# EAGLE design RGBWdriver (EAGLE 5.11)
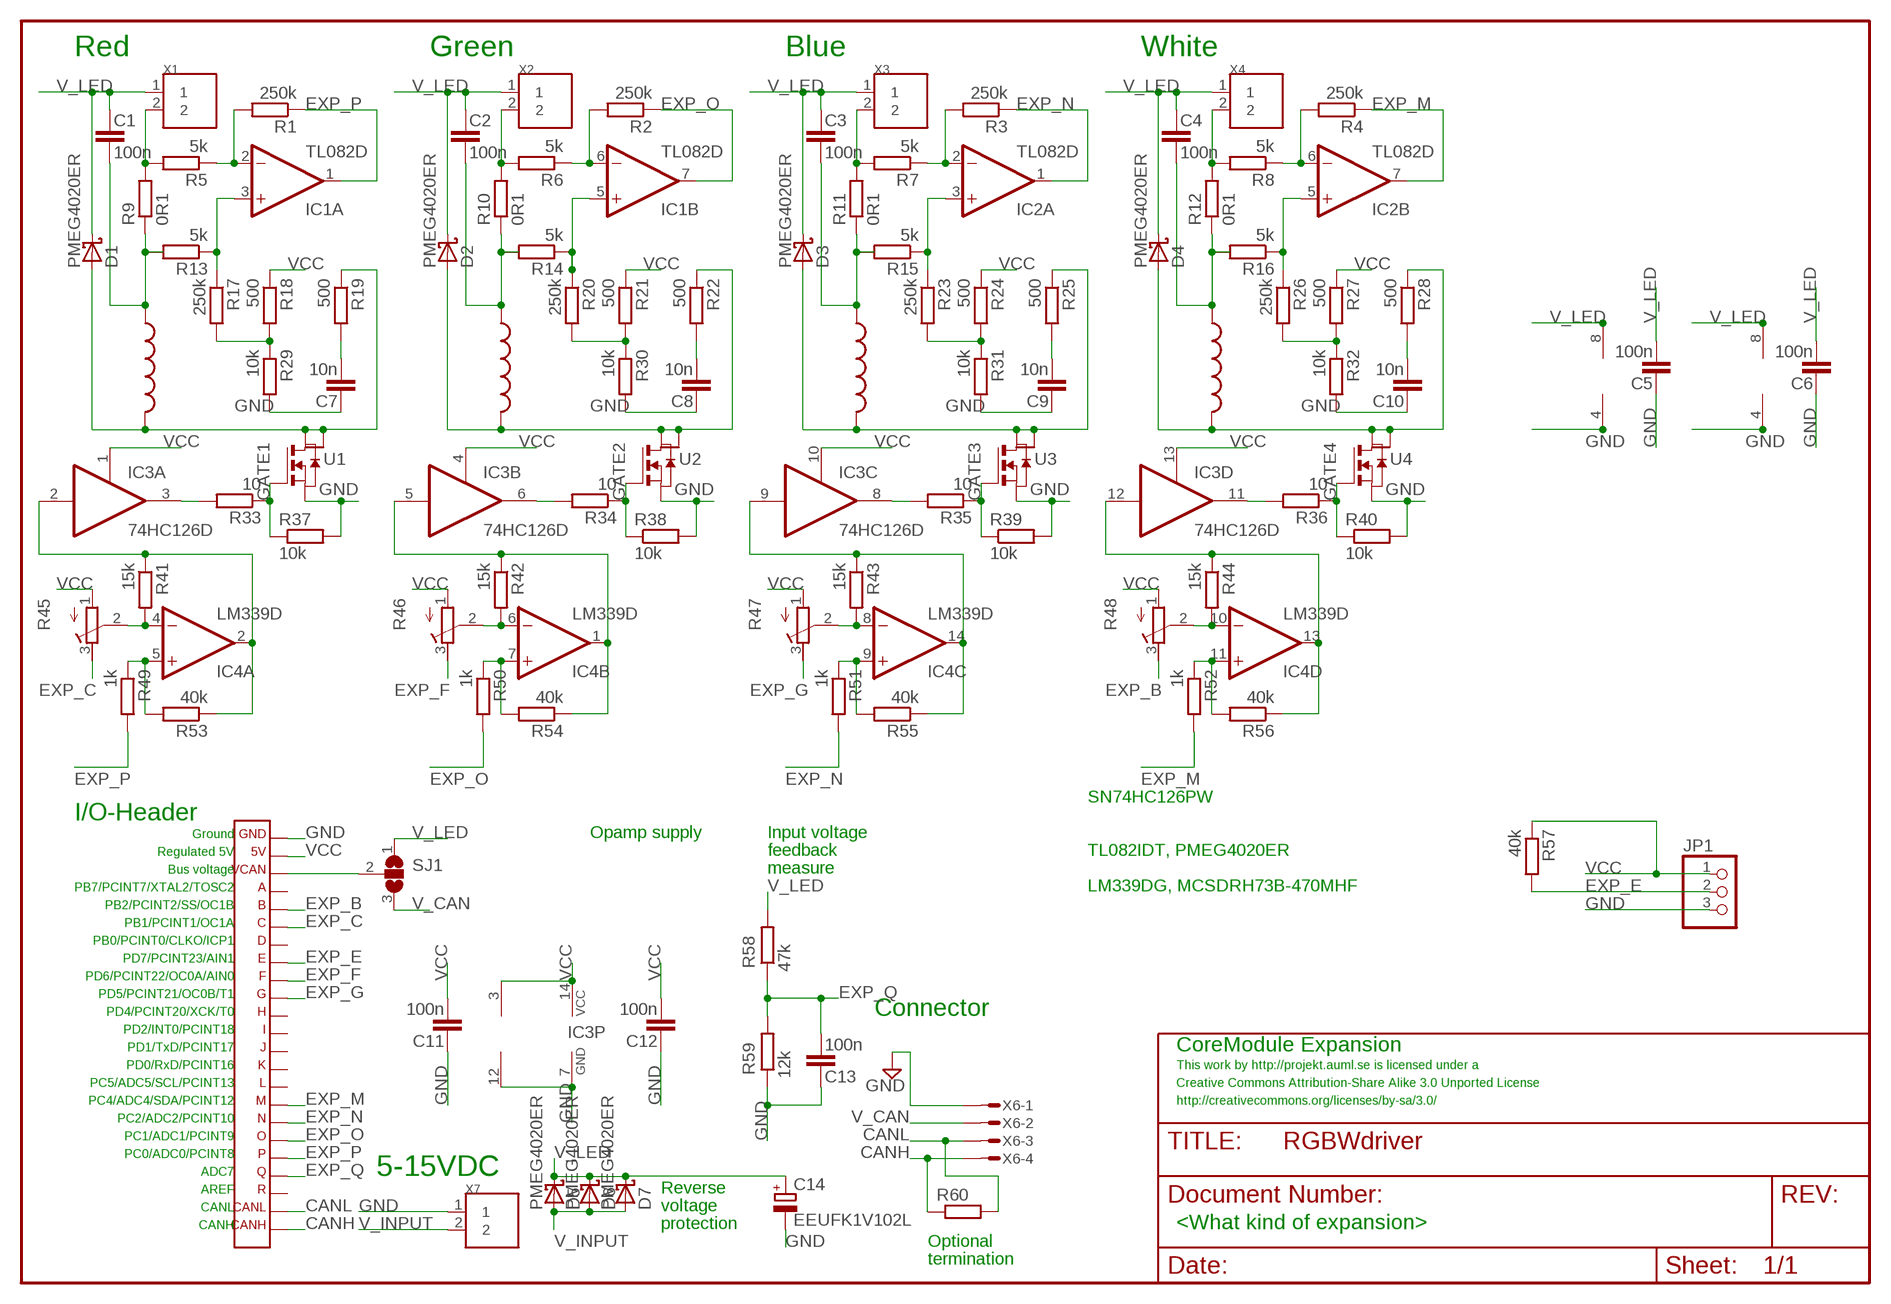
[diagram p0: schematic, sheet 1]

## Parts
C1  100n  C-EUC1210  [C1210]
C2  100n  C-EUC1210  [C1210]
C3  100n  C-EUC1210  [C1210]
C4  100n  C-EUC1210  [C1210]
C5  100n  C-EUC0603  [C0603]
C6  100n  C-EUC0603  [C0603]
C7  10n  C-EUC0603  [C0603]
C8  10n  C-EUC0603  [C0603]
C9  10n  C-EUC0603  [C0603]
C10  10n  C-EUC0603  [C0603]
C11  100n  C-EUC0603  [C0603]
C12  100n  C-EUC0603  [C0603]
C13  100n  C-EUC0603  [C0603]
C14  EEUFK1V102L  CPOL-EUTT5D10  [TT5D10]
D1  PMEG4020ER  SCHOTTKY-DIODE  [SOD-123W]
D2  PMEG4020ER  SCHOTTKY-DIODE  [SOD-123W]
D3  PMEG4020ER  SCHOTTKY-DIODE  [SOD-123W]
D4  PMEG4020ER  SCHOTTKY-DIODE  [SOD-123W]
D5  PMEG4020ER  SCHOTTKY-DIODE  [SOD-123W]
D6  PMEG4020ER  SCHOTTKY-DIODE  [SOD-123W]
D7  PMEG4020ER  SCHOTTKY-DIODE  [SOD-123W]
IC1  TL082D  [SO08]
IC2  TL082D  [SO08]
IC3  74HC126D  [SO14]
IC4  LM339D  [SO14]
JP1  PINHD-1X3  [1X03]
L1  12X12  [12X12]
L2  12X12  [12X12]
L3  12X12  [12X12]
L4  12X12  [12X12]
R1  250k  R-EUR0603  [R0603]
R2  250k  R-EUR0603  [R0603]
R3  250k  R-EUR0603  [R0603]
R4  250k  R-EUR0603  [R0603]
R5  5k  R-EUR0603  [R0603]
R6  5k  R-EUR0603  [R0603]
R7  5k  R-EUR0603  [R0603]
R8  5k  R-EUR0603  [R0603]
R9  0R1  R-EUR1206  [R1206]
R10  0R1  R-EUR1206  [R1206]
R11  0R1  R-EUR1206  [R1206]
R12  0R1  R-EUR1206  [R1206]
R13  5k  R-EUR0603  [R0603]
R14  5k  R-EUR0603  [R0603]
R15  5k  R-EUR0603  [R0603]
R16  5k  R-EUR0603  [R0603]
R17  250k  R-EUR0603  [R0603]
R18  500  R-EUR0603  [R0603]
R19  500  R-EUR0603  [R0603]
R20  250k  R-EUR0603  [R0603]
R21  500  R-EUR0603  [R0603]
R22  500  R-EUR0603  [R0603]
R23  250k  R-EUR0603  [R0603]
R24  500  R-EUR0603  [R0603]
R25  500  R-EUR0603  [R0603]
R26  250k  R-EUR0603  [R0603]
R27  500  R-EUR0603  [R0603]
R28  500  R-EUR0603  [R0603]
R29  10k  R-EUR0603  [R0603]
R30  10k  R-EUR0603  [R0603]
R31  10k  R-EUR0603  [R0603]
R32  10k  R-EUR0603  [R0603]
R33  10  R-EUR0603  [R0603]
R34  10  R-EUR0603  [R0603]
R35  10  R-EUR0603  [R0603]
R36  10  R-EUR0603  [R0603]
R37  10k  R-EUR0603  [R0603]
R38  10k  R-EUR0603  [R0603]
R39  10k  R-EUR0603  [R0603]
R40  10k  R-EUR0603  [R0603]
R41  15k  R-EUR0603  [R0603]
R42  15k  R-EUR0603  [R0603]
R43  15k  R-EUR0603  [R0603]
R44  15k  R-EUR0603  [R0603]
R45  R-TRIM  [TRIM_PVZ3]
R46  R-TRIM  [TRIM_PVZ3]
R47  R-TRIM  [TRIM_PVZ3]
R48  R-TRIM  [TRIM_PVZ3]
R49  1k  R-EUR0603  [R0603]
R50  1k  R-EUR0603  [R0603]
R51  1k  R-EUR0603  [R0603]
R52  1k  R-EUR0603  [R0603]
R53  40k  R-EUR0603  [R0603]
R54  40k  R-EUR0603  [R0603]
R55  40k  R-EUR0603  [R0603]
R56  40k  R-EUR0603  [R0603]
R57  40k  R-EUR0603  [R0603]
R58  47k  R-EUR0603  [R0603]
R59  12k  R-EUR0603  [R0603]
R60  R-EUR0603  [R0603]
SJ1  SJ_2_NO"  [SJ_2_NO]
U1  NFT3055L175  [SOT223]
U2  NFT3055L175  [SOT223]
U3  NFT3055L175  [SOT223]
U4  NFT3055L175  [SOT223]
X1  BLOCK2  [PCB2]
X2  BLOCK2  [PCB2]
X3  BLOCK2  [PCB2]
X4  BLOCK2  [PCB2]
X5  CORETWO_LAYOUTISPHOLES_CU  [CORETWO_LAYOUT_ISPHOLES_CU]
X6  MICROMATCH-4  [MICROMATCH-4]
X7  BLOCK2  [PCB2]

## Nets
CANH: R60.1 X5.CANH X6.4
CANL: R60.2 X5.CANL X6.3
EXP_B: R48.3(PAD3) X5.B
EXP_C: R45.3(PAD3) X5.C
EXP_E: JP1.2 R57.2 X5.E
EXP_F: R46.3(PAD3) X5.F
EXP_G: R47.3(PAD3) X5.G
EXP_M: IC2.7(B:OUT) R4.1 R52.2 X5.M
EXP_N: IC2.1(A:OUT) R3.1 R51.2 X5.N
EXP_O: IC1.7(B:OUT) R2.1 R50.2 X5.O
EXP_P: IC1.1(A:OUT) R1.1 R49.2 X5.P
EXP_Q: C13.2 R58.1 R59.2 X5.Q
GATE1: R33.1 R37.1 U1.1(G)
GATE2: R34.1 R38.1 U2.1(G)
GATE3: R35.1 R39.1 U3.1(G)
GATE4: R36.1 R40.1 U4.1(G)
GND: C5.1 C6.1 C7.1 C8.1 C9.1 C10.1 C11.1 C12.1 C13.1 C14.- IC1.4(P:V-) IC2.4(P:V-) IC3.7(P:GND) IC4.12(P:GND) JP1.3 R29.2 R30.2 R31.2 R32.2 R37.2 R38.2 R39.2 R40.2 R59.1 U1.3(S) U2.3(S) U3.3(S) U4.3(S) X5.GND X6.1 X7.1
L1: D1.A L1.P$2 R19.1 U1.2(D) U1.4(D_PAD)
L2: D4.A L4.P$2 R28.1 U4.2(D) U4.4(D_PAD)
L3: D2.A L2.P$2 R22.1 U2.2(D) U2.4(D_PAD)
L4: D3.A L3.P$2 R25.1 U3.2(D) U3.4(D_PAD)
N$1: IC4.5(A:+IN) R49.1 R53.2
N$2: IC3.2(A:I) IC4.2(A:OUT) R41.1 R53.1
N$3: C2.2 L2.P$1 R10.1 R14.2
N$4: R6.2 R10.2 X2.2
N$5: C1.2 L1.P$1 R9.1 R13.2
N$6: IC1.6(B:-IN) R2.2 R6.1
N$7: SJ1.2 X5.VCAN
N$9: IC1.5(B:+IN) R14.1 R20.1
N$11: C3.2 L3.P$1 R11.1 R15.2
N$12: R5.2 R9.2 X1.2
N$13: R7.2 R11.2 X3.2
N$14: IC2.2(A:-IN) R3.2 R7.1
N$17: IC2.3(A:+IN) R15.1 R23.1
N$19: IC1.3(A:+IN) R13.1 R17.1
N$20: C4.2 L4.P$1 R12.1 R16.2
N$21: IC1.2(A:-IN) R1.2 R5.1
N$22: R8.2 R12.2 X4.2
N$23: IC2.6(B:-IN) R4.2 R8.1
N$26: IC2.5(B:+IN) R16.1 R26.1
N$28: IC3.3(A:O) R33.2
N$29: C7.2 R19.2
N$30: IC4.4(A:-IN) R41.2 R45.2(PAD2)
N$32: R17.2 R18.2 R29.1
N$35: IC4.11(D:+IN) R52.1 R56.2
N$36: IC4.10(D:-IN) R44.2 R48.2(PAD2)
N$37: IC3.12(D:I) IC4.13(D:OUT) R44.1 R56.1
N$38: IC3.11(D:O) R36.2
N$39: R26.2 R27.2 R32.1
N$40: C10.2 R28.2
N$41: IC4.7(B:+IN) R50.1 R54.2
N$42: IC4.6(B:-IN) R42.2 R46.2(PAD2)
N$43: IC3.5(B:I) IC4.1(B:OUT) R42.1 R54.1
N$44: IC3.6(B:O) R34.2
N$45: R20.2 R21.2 R30.1
N$46: C8.2 R22.2
N$47: IC4.9(C:+IN) R51.1 R55.2
N$48: IC4.8(C:-IN) R43.2 R47.2(PAD2)
N$49: IC3.9(C:I) IC4.14(C:OUT) R43.1 R55.1
N$50: IC3.8(C:O) R35.2
N$51: R23.2 R24.2 R31.1
N$52: C9.2 R25.2
V_CAN: SJ1.3 X6.2
V_INPUT: D5.A D6.A D7.A X7.2
V_LED: C1.1 C2.1 C3.1 C4.1 C5.2 C6.2 C14.+ D1.C D2.C D3.C D4.C D5.C D6.C D7.C IC1.8(P:V+) IC2.8(P:V+) R58.2 SJ1.1 X1.1 X2.1 X3.1 X4.1
VCC: C11.2 C12.2 IC3.1(A:OE) IC3.4(B:OE) IC3.10(C:OE) IC3.13(D:OE) IC3.14(P:VCC) IC4.3(P:V+) JP1.1 R18.1 R21.1 R24.1 R27.1 R45.1(PAD1) R46.1(PAD1) R47.1(PAD1) R48.1(PAD1) R57.1 X5.5V
Unconnected: X5.A X5.D X5.H X5.I X5.J X5.K X5.L X5.R

## Notes on the sheet
- Red | Green | Blue | White
- SN74HC126PW
- I/O-Header
- Ground | Opamp supply | Input voltage
- Regulated 5V | feedback | TL082IDT, PMEG4020ER
- Bus voltage | measure
- PB7/PCINT7/XTAL2/TOSC2 | LM339DG, MCSDRH73B-470MHF
- PB2/PCINT2/SS/OC1B
- PB1/PCINT1/OC1A
- PB0/PCINT0/CLKO/ICP1
- PD7/PCINT23/AIN1
- PD6/PCINT22/OC0A/AIN0
- PD5/PCINT21/OC0B/T1
- PD4/PCINT20/XCK/T0 | Connector
- PD2/INT0/PCINT18
- PD1/TxD/PCINT17 | CoreModule Expansion
- PD0/RxD/PCINT16 | This work by http://projekt.auml.se is licensed under a
- PC5/ADC5/SCL/PCINT13 | Creative Commons Attribution-Share Alike 3.0 Unported License
- PC4/ADC4/SDA/PCINT12 | http://creativecommons.org/licenses/by-sa/3.0/
- PC2/ADC2/PCINT10
- PC1/ADC1/PCINT9
- PC0/ADC0/PCINT8
- ADC7 | 5-15VDC
- AREF | Reverse
- CANL | voltage
- CANH | protection | <What kind of expansion>
- Optional
- termination

## Library data of the parts
C1-C13 = rcl:C-EU
C14 = rcl:CPOL-EU: POLARIZED CAPACITOR, European symbol
D1-D7 = diode:SCHOTTKY-DIODE
IC1 IC2 = linear:TL082: OP AMP
IC3 = 74xx-eu:74*126: Quad bus BUFFER, 3-state
IC4 = linear:LM339: Low Power Low Offset Voltage Quad Comparators with open collector; LM139/LM239/LM339/LM2901/LM3302
JP1 = pinhead:PINHD-1X3: PIN HEADER
L1-L4 = inductor10x10:12X12
R1-R44 R49-R60 = rcl:R-EU
R45-R48 = rcl:R-TRIM
SJ1 = jumper:SJ_2_NO
U1-U4 = NMOS_NTF3055L175:NFT3055L175
X1-X4 X7 = terminal_block:BLOCK2
X5 = expboard:CORETWO_LAYOUT
X6 = con-amp-micromatch:MICROMATCH-4: MicroMaTch 4 7-215464-4 / 0-215464-4 Drawing Number C-215464 DDEController.pdf

## Board
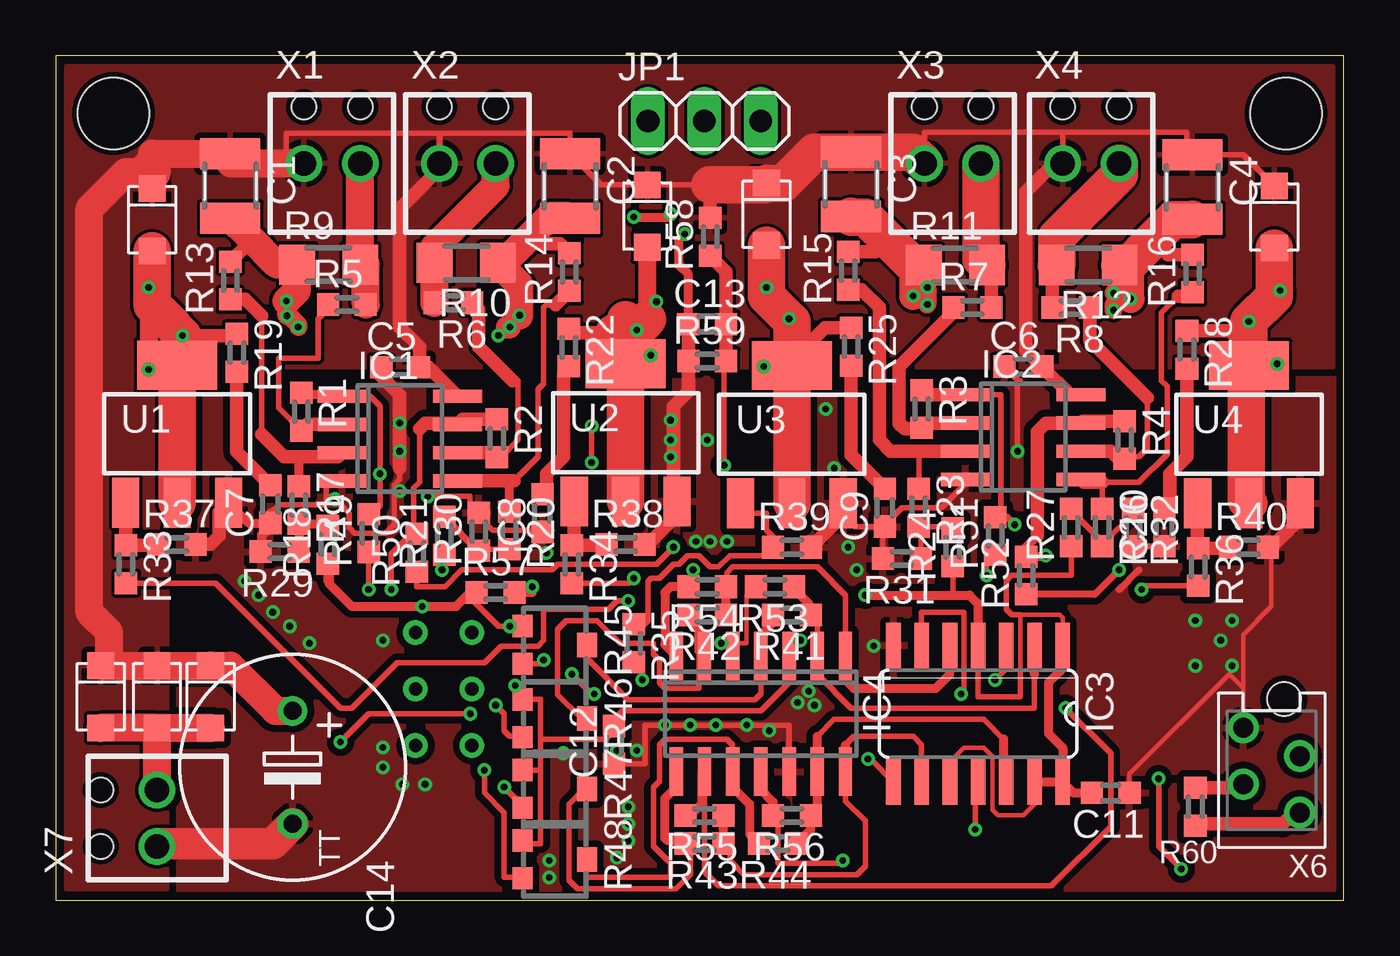
[diagram p1: board, top side]
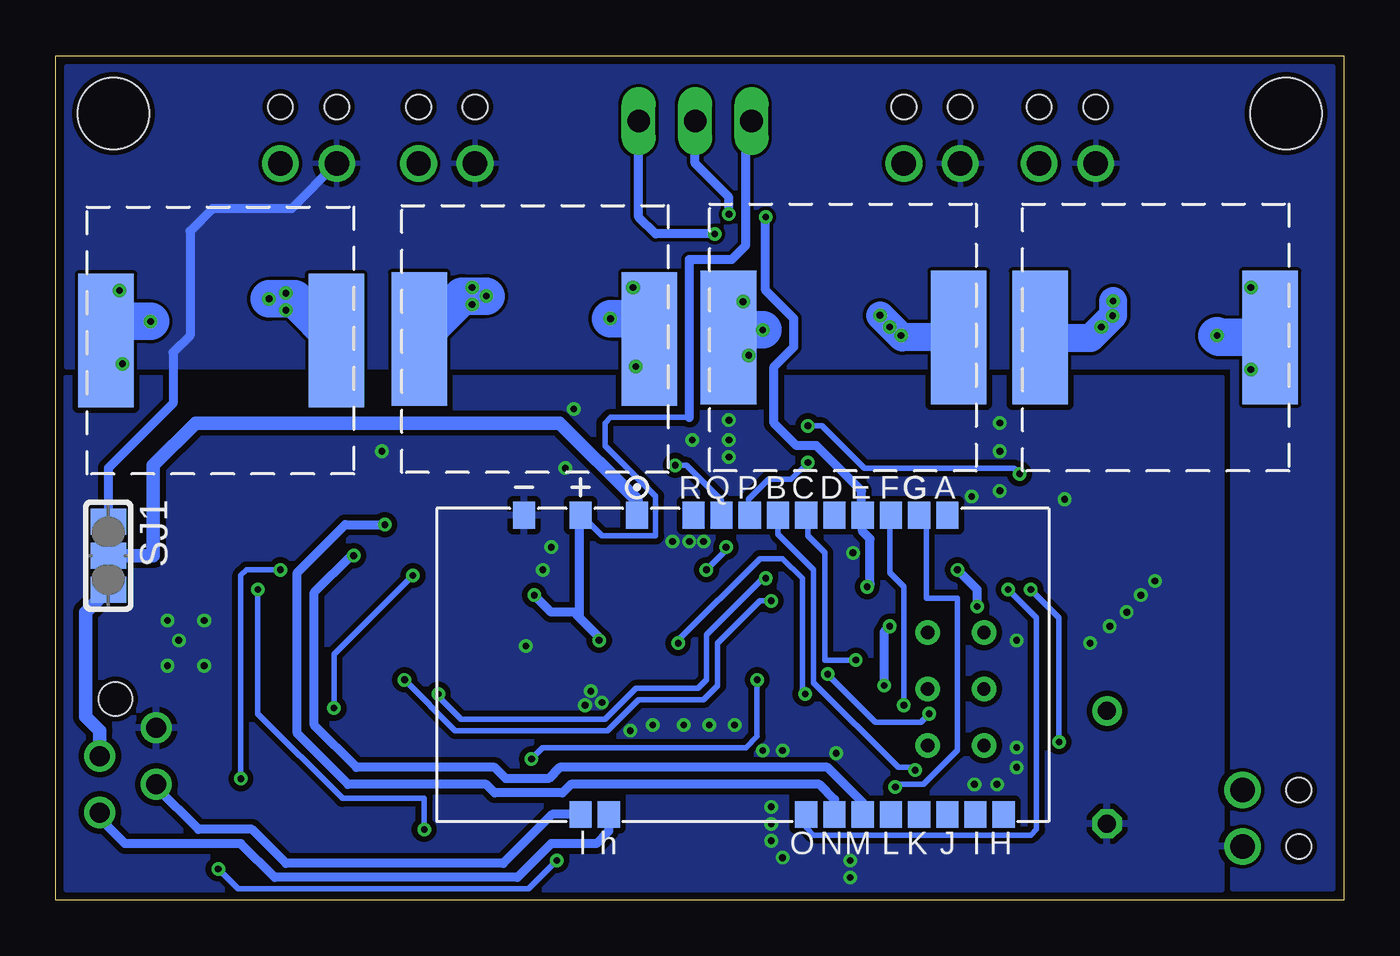
[diagram p2: board, bottom side, seen from below]

Size 58 x 38 mm. Coordinates in mm from the lower left corner, seen from the top.
Outline: 0,0 58,0 58,38 0,38 0,0
Copper layers (1*16): Top 0.035mm / dielectric 1.5mm / Bottom 0.035mm
Design rules "ITead_rule *": minimum track width 6mil, minimum drill 12mil, track to track 6mil, track to pad 6mil, pad to pad 6mil, via to via 6mil, smd to smd 0mil, copper to edge 10mil, drill to drill 10mil, minimum pad ring 10mil, minimum via ring 6mil, stop-mask expansion 2mil, vias tented up to drill 100mil, thermal gap 10mil
Holes 3.2 mm at 2.6,35.4 55.4,35.4

### Footprints (pad centres in the part's own frame; a part is rotated, then mirrored left to right if it is on the bottom)
C1210 = smd 1.4 x 2.7: 1 -1.4,0; 2 1.5,0
C0603 = smd 1 x 1: 1 -0.85,0; 2 0.85,0
TT5D10 = drill 0.813 round: + -2.54,0 | drill 0.813 octagon: - 2.54,0
SOD-123W = smd 1.2 x 1.2: A 1.4,0; C -1.4,0
SO08 = smd 0.6 x 2.2: 1 -1.905,-2.6; 2 -0.635,-2.6; 3 0.635,-2.6; 4 1.905,-2.6; 5 1.905,2.6; 6 0.635,2.6; 7 -0.635,2.6; 8 -1.905,2.6
SO14 = smd 0.66 x 2.032: 1 -3.81,-3.073; 2 -2.54,-3.073; 3 -1.27,-3.073; 4 0,-3.073; 5 1.27,-3.073; 6 2.54,-3.073; 7 3.81,-3.073; 8 3.81,3.073; 9 2.54,3.073; 10 1.27,3.073; 11 0,3.073; 12 -1.27,3.073; 13 -2.54,3.073; 14 -3.81,3.073
SO14' = smd 0.6 x 2.2: 1 -3.81,-2.6; 2 -2.54,-2.6; 3 -1.27,-2.6; 4 0,-2.6; 5 1.27,-2.6; 6 2.54,-2.6; 7 3.81,-2.6; 8 3.81,2.6; 9 2.54,2.6; 10 1.27,2.6; 11 0,2.6; 12 -1.27,2.6; 13 -2.54,2.6; 14 -3.81,2.6
1X03 = drill 1.016 long: 1 -2.54,0; 2 0,0; 3 2.54,0
12X12 = smd 6 x 2.5: P$1 6,0.79; P$2 6,11.15
R0603 = smd 0.991 x 1.016: 1 -0.85,0; 2 0.85,0
R1206 = smd 1.6 x 1.803: 1 -1.422,0; 2 1.422,0
TRIM_PVZ3 = smd 1 x 0.9: 1 0.5,0.45; 3 2.2,0.45 | smd 1.1 x 0.9: 2 1.35,3.35
SJ_2_NO = smd 1.168 x 1.6: 1 -1.524,0; 2 0,0; 3 1.524,0
SOT223 = smd 1.219 x 2.235: 1 -2.311,-3.099; 2 0,-3.099; 3 2.311,-3.099 | smd 3.6 x 2.2: 4 0,3.099
PCB2 = drill 1.1 round: 1 -2.54,0; 2 0,0 | hole 1.1: -2.54,2.54; 0,2.54
CORETWO_LAYOUT_ISPHOLES_CU = smd 1 x 1.2: 5V 7.315,-6.648; A -9.195,-6.648; B -1.575,-6.648; C -2.845,-6.648; CANH 6.045,6.814; CANL 7.315,6.814; D -4.115,-6.648; E -5.385,-6.648; F -6.655,-6.648; G -7.925,-6.648; GND 9.855,-6.648; H -11.735,6.814; I -10.465,6.814; J -9.195,6.814; K -7.925,6.814; L -6.655,6.814; M -5.385,6.814; N -4.115,6.814; O -2.845,6.814; P -0.305,-6.648; Q 0.965,-6.648; R 2.235,-6.648; VCAN 4.775,-6.648 | drill 0.6 round: P$1 -10.846,3.708; P$2 -8.306,3.708; P$3 -10.846,1.168; P$4 -8.306,1.168; P$5 -8.306,-1.372; P$6 -10.846,-1.372
MICROMATCH-4 = drill 0.9 round: 1 1.905,1.27; 2 0.635,-1.27; 3 -0.635,1.27; 4 -1.905,-1.27 | hole 1.5: 3.199,-0.562

### Placement (x,y rotation side)
C1  7.87,32.19 270 top
C2  23.16,32.18 270 top
C3  35.81,32.26 270 top
C4  51.18,32.13 270 top
C5  15.52,23.98 0 top
C6  43.56,24 0 top
C7  9.67,17.81 90 top
C8  21.92,17.41 90 top
C9  37.34,17.65 90 top
C10  49.91,16.76 90 top
C11  47.5,4.83 180 top
C12  25.15,6.99 90 top
C13  29.34,25.91 0 top
C14  10.67,5.97 270 top
D1  4.35,30.61 270 top
D2  26.64,30.78 270 top
D3  32,30.86 270 top
D4  54.86,30.73 270 top
D5  2.03,9.14 270 top
D6  4.57,9.14 270 top
D7  6.99,9.14 270 top
IC1  15.5,20.77 270 top
IC2  43.56,20.83 270 top
IC3  41.53,8.38 180 top
IC4  LM339D  [SO14']  31.75,8.38 180 top
JP1  29.21,35.05 0 top
L1  14.48,31.32 270 bottom
L2  16.56,19.32 90 bottom
L3  42.42,31.24 270 bottom
L4  44.58,19.18 90 bottom
R1  11.06,21.98 270 top
R2  19.87,20.78 270 top
R3  38.99,22.1 270 top
R4  48.13,20.7 270 top
R5  13.11,26.8 0 top
R6  17.91,26.88 180 top
R7  41.27,26.67 0 top
R8  45.72,26.67 180 top
R9  12.3,28.59 0 top
R10  18.49,28.67 180 top
R11  40.51,28.57 0 top
R12  46.48,28.57 180 top
R13  7.87,27.88 90 top
R14  23.13,28.26 90 top
R15  35.69,28.32 90 top
R16  51.18,28.19 90 top
R17  10.96,17.77 270 top
R18  12.25,15.99 90 top
R19  8.16,24.62 270 top
R20  20.43,16.63 270 top
R21  17.49,16.39 90 top
R22  23.1,24.86 270 top
R23  38.86,17.65 270 top
R24  40.39,15.88 90 top
R25  35.81,24.89 270 top
R26  47.12,16.76 270 top
R27  45.72,16.76 90 top
R28  50.93,24.77 270 top
R29  10.09,15.68 180 top
R30  19.05,16.58 90 top
R31  38.1,15.37 180 top
R32  48.51,16.76 270 top
R33  3.17,15.11 270 top
R34  23.24,15.11 270 top
R35  26.04,11.56 270 top
R36  51.44,14.99 270 top
R37  5.46,16 0 top
R38  25.65,16 0 top
R39  33.15,15.88 0 top
R40  53.72,15.88 0 top
R41  33.15,12.83 180 top
R42  29.34,12.83 180 top
R43  29.21,2.54 180 top
R44  32.51,2.54 180 top
R45  20.57,12.83 270 top
R46  20.57,9.53 270 top
R47  20.57,6.35 270 top
R48  20.57,3.17 270 top
R49  14.1,16.51 90 top
R50  16.26,15.62 90 top
R51  42.29,16.38 90 top
R52  43.69,14.61 90 top
R53  32.38,14.1 180 top
R54  29.34,14.1 180 top
R55  29.21,3.81 180 top
R56  33.15,3.81 180 top
R57  19.81,13.84 0 top
R58  29.46,29.84 90 top
R59  29.34,24.26 0 top
R60  51.31,4.19 90 top
SJ1  55.63,15.49 270 bottom
U1  5.48,20.97 0 top
U2  25.66,21.04 0 top
U3  33.15,20.95 0 top
U4  53.72,20.95 0 top
X1  13.72,33.15 0 top
X2  19.81,33.15 0 top
X3  41.66,33.15 0 top
X4  47.88,33.15 0 top
X5  27.05,10.67 180 bottom
X6  54.74,5.84 90 top
X7  4.57,4.95 90 top

### Tracks (layer width: path | path; a pad name or v marks a point on that pad's centre or on a via)
CANH
  Top 0.61: R60.1 51.4,3.43 55.24,3.43 55.75,3.94 X6.4
  Bottom 0.406: X5.CANH 33.1,3.1 33.66,2.54 35.69,2.54 37.21,1.02 48.13,1.02 49.66,2.54 54.86,2.54 56.01,3.68 X6.4
CANL
  Top 0.61: X6.3 53.3,5.04 R60.2
  Bottom 0.406: X5.CANL 35.64,3.85 37.85,1.65 47.62,1.65 49.15,3.17 51.56,3.17 53.47,5.08 X6.3
EXP_B  (via drill 0.3)
  Top 0.254: v19.3,5.84 19.3,4.83 20.19,3.94 20.19,1.02 20.98,1.02 R48.3
  Bottom 0.254: X5.B 25.48,16.46 23.88,14.86 23.88,9.78 20.07,5.97 19.43,5.97 v19.3,5.84
EXP_C  (via drill 0.3)
  Top 0.254: v21.97,10.79 21.8,10.63 R45.3
  Bottom 0.254: v21.97,10.79 23.37,10.79 23.37,15.62 24.13,16.38 24.13,17.32 X5.C
EXP_E  (via drill 0.3)
  Top 0.406: v26.04,30.73 27.69,30.73 v27.69,30.86 | R57.2 21.46,13.84 v21.46,14.1
  Bottom 0.406: v26.04,30.73 26.04,27.43 24.77,26.16 24.77,24.89 25.65,24 25.65,21.46 24.64,20.45 23.75,20.45 21.72,18.41 21.72,17.32 X5.E 21.67,16.59 21.34,16.26 21.34,14.22 v21.46,14.1 | v27.69,30.86 27.69,31.62 29.21,33.15 JP1.2
EXP_F  (via drill 0.3)
  Top 0.254: v19.81,8.76 20.19,8.38 20.19,7.62 20.45,7.37 20.98,7.37 R46.3
  Bottom 0.254: v19.81,8.76 19.81,14.1 20.45,14.73 20.45,16.76 20.4,16.82 X5.F
EXP_G  (via drill 0.3)
  Top 0.254: 20.94,4.06 R47.3 21.02,4.25 v20.19,5.08
  Bottom 0.254: X5.G 18.8,17.32 18.8,13.59 17.4,13.59 17.4,6.73 18.92,5.21 20.07,5.21 v20.19,5.08
EXP_M  (via drill 0.3)
  Top 0.406: v44.58,15.49 44.58,15.46 R52.2 43.69,15.88 44.2,16.38
  Top 0.61: R4.1 46.25,21.55 IC2.7 44.58,21.46 44.2,21.08 44.2,16.38
  Bottom 0.406: X5.M 21.67,4.39 23.24,5.97 35.31,5.97 35.81,5.46 37.72,5.46 38.23,5.97 44.45,5.97 46.35,7.87 46.35,13.84 44.7,15.49 v44.58,15.49
EXP_N  (via drill 0.3)
  Top 0.254: IC2.1 42.55,22.73 42.55,17.53 42.29,17.27 R51.2 42.55,17.49
  Top 0.305: v43.18,16.89 42.84,17.23 R51.2
  Top 0.61: IC2.1 39.2,22.73 R3.1
  Bottom 0.406: X5.N 22.94,4.52 23.62,5.21 34.8,5.21 35.18,4.83 38.23,4.83 38.61,5.21 44.83,5.21 47.12,7.49 47.12,14.73 44.96,16.89 v43.18,16.89
EXP_O  (via drill 0.3)
  Top 0.254: v15.11,13.97 15.11,15.58 16,16.47 R50.2 16.13,16.47 16.13,18.54 16.38,18.8 16.38,21.21
  Top 0.61: R2.1 18.33,21.63 IC1.7 18.03,21.46 16.64,21.46 16.38,21.21
  Bottom 0.254: X5.O 24.21,3.25 23.88,2.92 14.1,2.92 13.84,3.17 13.84,12.7 v15.11,13.97
EXP_P  (via drill 0.3)
  Top 0.254: v24.13,21.34 v24.13,19.68 | IC1.1 14.16,22.67 14.61,22.23 v14.61,19.18 14.61,17.74 14.22,17.36 R49.2
  Top 0.406: IC1.1 12.13,22.67 12.06,22.73 11.15,22.73 R1.1
  Bottom 0.254: v24.13,19.68 24.89,18.92 25.91,18.92 26.8,18.03 26.8,17.32 X5.P | v24.13,21.34 23.5,21.34 21.59,19.43 14.86,19.43 v14.61,19.18
EXP_Q  (via drill 0.3)
  Top 0.254: v30.1,19.56 30.1,24.13
  Top 0.61: C13.2 30.19,28.27 R58.1 | C13.2 R59.2 | C13.2 30.19,24.17 30.23,24.13 30.1,24.13
  Bottom 0.254: 28.07,17.32 X5.Q 28.02,17.98 29.59,19.56 v30.1,19.56
GATE1
  Top 0.61: U1.1 3.17,15.97 R33.1 4.57,15.96 R37.1
GATE2
  Top 0.61: U2.1 23.35,16.07 R34.1 24.77,15.96 R38.1
GATE3
  Top 0.254: R35.1 26.5,12.41 26.67,12.57 26.67,14.35 26.8,14.48 27.18,14.48 27.81,15.11 28.07,15.11 28.45,15.49 28.96,15.49 29.46,14.99 29.84,14.99 30.35,15.49 31.92,15.49 R39.1 32.3,16.34 32,16.64 32,17.4 31.29,17.4 30.86,17.83
  Top 0.61: R39.1 32.13,15.71 | 30.86,17.83 U3.1
GATE4
  Top 0.61: U4.1 51.41,15.86 R36.1 52.83,15.84 R40.1
GND  (via drill 0.3)
  Top 0.203: 53.47,9.53 X6.1 | 53.47,9.53 53.47,11.94 54.74,13.21 54.74,15.88 | 53.47,9.53 52.83,10.16 48.35,5.68 C11.1
  Top 0.254: 9.67,17.42 10.03,17.78 12.06,17.78 12.19,17.91 12.19,18.67 | C8.1 21.58,16.64 19.68,16.64 19.17,17.15 R30.2 18.67,17.8 18.67,18.16 v16.76,18.16 | C9.1 35.99,16.8 35.46,17.34 | R31.2 37.25,16.71 C9.1 | C9.1 37.34,16.89 38.1,17.65 39.88,17.65 40.96,18.74 IC2.4 | C10.1 R32.2 | 15.49,19.43 15.49,18.92 15.24,18.67 15.24,16.89 14.86,16.51 13.46,16.51 13.21,16.76 13.21,17.4 v12.57,18.03 | IC4.12 33.02,7.87 v31.11,7.87 v29.72,7.87 v28.57,7.87 v27.43,7.87 26.54,7.87 26.54,6.13 C12.1 | C6.1 43.35,23.37 43.43,23.37 43.31,23.24 v43.31,20.19
  Top 0.305: 47.88,13.97 48.77,14.86
  Top 0.406: C7.1 8.7,16.96 U1.3 | C7.1 9.67,16.78 9.27,16.38 9.27,15.71 R29.2 | C7.1 9.67,17.42 | 12.19,18.67 12.32,18.8 12.83,18.8 IC1.4 | C13.1 28.49,28.16 28.07,28.57 28.07,29.72 v28.32,29.97
  Top 0.61: C5.1 14.67,23.56 15.49,22.73 v15.49,21.46 v15.49,20.19 15.49,19.43 | C13.1 R59.1 28.49,22.9 27.81,22.23 27.81,18.1 U2.3 27.94,17.9 27.94,17.27 26.67,16 R38.2 | R40.2 54.74,15.88 56.01,17.14 56.01,17.83 U4.3 | U3.3 35.46,17.34 R39.2 | R37.2 6.99,16 7.37,16.38 7.37,17.45 U1.3
  Top 1.422: X7.1 4.7,2.54 9.78,2.54 C14.-
  Bottom 0.406: v28.32,29.97 30.99,29.97 31.75,30.73 JP1.3
  other vias: 8.51,14.35 9.14,13.72 9.78,12.95 11.43,11.56 10.54,12.32 14.73,6.86 14.73,5.97 15.62,5.21 16.64,5.21 14.73,11.68 27.69,21.59 27.69,20.7 27.69,19.94 34.67,22.1 35.05,19.43 51.31,12.57 51.31,10.54 52.45,11.68 52.96,12.57 52.96,10.54 35.69,15.88 36.07,14.86 36.83,11.43 34.16,8.76 22.23,1.02 22.1,15.62 15.49,18.41 29.34,20.7 28.83,16.13 29.46,16.13 30.23,16.13 33.4,8.89 33.91,9.4 32.13,7.62 22.86,6.6 25.27,6.73 26.16,6.73 22.23,1.78 25.27,1.91 25.78,2.67 25.78,3.43 25.78,4.19
  pour Bottom (isolate 0.254, rank 3): 5.5,23.5 57.5,23.5 57.5,0.5 5.5,0.5
  pour Top (isolate 0.305, rank 3): 5.5,23.5 57.5,23.5 57.5,0.5 5.5,0.5
L1  (via drill 0.3)
  Top 0.61: R19.1 8.16,25.4 v5.71,25.4
  Top 0.813: v4.19,23.88 v4.19,27.56 5.71,26.04 v5.71,25.4
  Top 1.676: D1.A 4.35,26.77 v5.71,25.4 5.71,24.31 U1.4 U1.2
  Bottom 1.676: L1.P$2 5.63,25.32 v5.71,25.4
L2  (via drill 0.3)
  Top 0.61: R28.1 52.87,25.61 53.72,24.77
  Top 0.813: 54.86,27.43 v55.12,27.43
  Top 1.676: D4.A 54.86,27.43 54.86,27.18 v53.72,26.04 53.72,24.77 U4.4 53.65,24.05 53.59,24 53.59,17.98 U4.2
  Bottom 0.61: v54.99,24.13 55.73,24.87 L4.P$2
  Bottom 1.676: v53.72,26.04 54.87,26.04 L4.P$2
L3  (via drill 0.3)
  Top 0.61: R22.1 23.28,25.53 25.15,25.53 25.65,25.53 25.66,25.52 U2.4
  Top 0.813: 26.64,26.13 D2.A
  Top 1.676: 25.66,26.1 U2.4 U2.2 | 25.15,25.53 26.04,25.53 v26.16,25.65 26.64,26.13
  Bottom 0.406: v26.16,25.65 26.16,25.32 26.8,25.32 | 26.8,25.32 v26.8,24.51 | 26.8,25.32 L2.P$2 | v27.05,26.92 27.05,25.65 27.3,25.65
  Bottom 1.676: v26.16,25.65 27.3,25.65 27.37,25.65
L4  (via drill 0.3)
  Top 0.61: R25.1 34.63,25.74 33.78,24.89 33.15,24.89
  Top 1.016: v31.88,24 31.93,24.05 U3.4
  Top 1.676: D3.A v32,27.56 32,27.18 v33.02,26.16 33.15,26.04 33.15,24.89 U3.4 U3.2
  Bottom 1.676: v33.02,26.16 32.19,26.16 L3.P$2
N$1  (via drill 0.3)
  Top 0.203: 31.54,13.88 31.37,13.72 31.11,13.72 31.11,11.56 30.48,11.56
  Top 0.254: v18.67,8.38 14.1,8.38 v12.83,7.11 | v14.1,13.97 R49.1 | v29.97,11.56 30.48,11.56 IC4.5 | v23.24,10.16 24.13,9.27 v24.26,9.27
  Top 0.406: 31.54,13.88 R53.2
  Bottom 0.254: v24.26,9.27 24.38,9.4 24.38,14.48 25.27,15.37 26.29,15.37 29.97,11.68 v29.97,11.56 | v23.24,10.16 21.08,8 19.05,8 v18.67,8.38 | v12.83,7.11 12.83,12.7 v14.1,13.97
N$2
  Top 0.254: 44.07,10.16 44.07,8.64 35.81,8.64 34.29,10.16 IC4.2 34.29,12.53 R41.1
  Top 0.406: 44.07,10.16 IC3.2 | R53.1 33.23,14.01 33.91,13.34 33.91,12.91 R41.1
N$3  (via drill 0.3)
  Top 0.61: R14.2 22.72,29.52 21.02,29.52 | 20.32,25.78 v19.94,25.4 20.85,26.31
  Top 1.016: 20.32,25.78 v20.45,25.78 | v20.89,26.31 20.85,26.31
  Top 1.27: C2.2 23.04,30.79 22.29,30.79 21.02,29.52 20.18,28.67 R10.1 20.89,27.7 v20.89,26.31
  Bottom 1.27: L2.P$1 19.89,25.32 v20.89,26.31
N$4
  Top 1.27: X2.2 19.81,32.15 17.05,29.38 17.05,28.69 R10.2 R6.2
N$5  (via drill 0.3)
  Top 0.61: R13.2 8.74,29.6 8.74,29.82
  Top 0.813: v10.41,26.29 10.39,26.31 10.39,26.42 10.92,25.88 v10.92,25.78
  Top 1.27: C1.2 8.74,29.82 9.96,28.59 R9.1 10.88,27.44 v10.39,26.95
  Bottom 0.813: 10.39,26.31 v10.41,26.29
  Bottom 1.27: v10.39,26.95 10.39,26.31 11.41,25.29 13.66,25.29 L1.P$1
N$6
  Top 0.254: 20.57,23.37 20.83,23.37 20.83,20.7 20.06,19.93
  Top 0.61: IC1.6 19.68,20.13 R2.2 20.06,19.93 | R6.1 19.05,26.58 19.05,24.89 20.57,23.37
N$7
  Bottom 0.254: SJ1.2 55.63,13.84
  Bottom 0.61: SJ1.2 53.59,15.49 53.59,19.56 51.69,21.46 35.31,21.46 31.88,18.03 31.88,17.32 X5.VCAN
N$9
  Top 0.254: 22.52,26.8 22.1,26.8 21.97,26.67 21.97,23.24 21.72,22.99 21.72,19.94 20.64,18.86
  Top 0.406: R20.1 20.43,18.84 20.45,18.86
  Top 0.61: 22.52,26.8 R14.1 | IC1.5 20.45,18.86 20.64,18.86
N$11  (via drill 0.3)
  Top 0.254: R11.1 38.61,28.57
  Top 0.61: R15.2 36.92,29.17 37.47,29.72
  Top 0.813: v38.61,27.18 38.86,27.18 v39.24,27.56 v39.24,26.8
  Top 1.27: v38.61,27.18 38.61,28.07 39.09,28.55 R11.1
  Top 1.676: 38.61,28.57 37.47,29.72 36.45,30.73 35.84,30.73 C3.2
  Bottom 1.676: v38.61,27.18 39.69,27.18 L3.P$1
N$12
  Top 1.27: X1.2 R9.2 13.96,28.59 R5.2
N$13
  Top 0.61: R7.2 42.12,28.39 R11.2
  Top 1.676: X3.2 41.66,28.85 R11.2
N$14
  Top 0.61: IC2.2 39.2,21.46 R3.2 38.95,21.21 38.23,21.21 37.97,21.46 37.97,24 40.42,26.45 R7.1
N$17
  Top 0.254: 38.86,20.19 R23.1
  Top 0.61: R15.1 36.28,27.47 37.08,26.67 37.08,20.7 37.59,20.19 38.86,20.19 IC2.3
N$19
  Top 0.254: 9.27,20.95 9.27,26.29
  Top 0.406: R17.1 10.96,19.9 10.92,19.94
  Top 0.61: R13.1 8.53,27.03 9.27,26.29 | 9.27,20.95 10.29,19.94 10.92,19.94 12.71,19.94 IC1.3
N$20  (via drill 0.3)
  Top 0.61: R16.2 50.08,29.04 49.4,29.72
  Top 0.813: 47.88,27.05 v47.62,27.3 | v48.39,27.05 47.88,27.05 | 47.88,27.05 47.62,26.8 v47.62,26.54
  Top 1.27: v48.39,27.05 48.39,28.57 R12.1
  Top 1.676: R12.1 48.26,28.57 49.4,29.72 50.29,30.61 51.16,30.61 C4.2
  Bottom 1.676: v48.39,27.05 47.24,27.05 L4.P$1
N$21
  Top 0.254: 12.26,26.61 11.81,26.16 11.81,24.38 10.03,24.38 10.03,22.15 R1.2
  Top 0.61: R1.2 11.33,21.4 IC1.2 | 12.26,26.61 R5.1
N$22
  Top 0.61: R8.2 44.87,28.39 R12.2
  Top 1.676: X4.2 47.88,32.64 45.09,29.84 45.09,28.6 R12.2
N$23
  Top 0.254: 49.15,22.61 49.15,20.32 48.77,19.94 48.22,19.94
  Top 0.61: IC2.6 47.5,20.19 47.84,19.85 R4.2 48.22,19.94 | R8.1 46.57,25.18 49.15,22.61
N$26
  Top 0.254: 50.55,27.18 49.78,26.42 49.78,23.37 50.04,23.11 50.04,20.07 48.77,18.8 47.12,18.8 R26.1
  Top 0.61: R16.1 51.18,27.18 50.55,27.18 | 47.12,18.8 46.29,18.8 IC2.5
N$28  (via drill 0.3)
  Top 0.254: v42.29,9.91 42.8,10.41 IC3.3 | R33.2 7.2,14.26 12.83,8.64 13.34,8.64 15.37,10.67 19.3,10.67 20.07,11.43 21.72,11.43 21.97,11.68 21.97,13.08 24.89,13.08 25.27,13.46 v25.78,13.46
  Bottom 0.254: v25.78,13.46 26.29,13.46 28.19,11.56 28.19,9.65 28.83,9.02 31.75,9.02 33.15,7.62 40.01,7.62 v42.29,9.91
N$29
  Top 0.61: R19.2 8.16,20.17 C7.2
N$30
  Top 0.254: IC4.4 31.75,9.27 31.5,9.02 25.78,9.02 23.92,10.87 R45.2
  Top 0.406: R41.2 32.3,12.48 31.75,11.94 IC4.4
N$32
  Top 0.406: R18.2 12.17,16.92 R17.2 10.96,15.7 R29.1
N$35  (via drill 0.3)
  Top 0.254: 32.51,3.56 32.64,3.68 | 32.51,3.56 32.51,1.65 35.18,1.65 35.31,1.78 v35.43,1.78 | v50.67,1.4 49.66,2.41 v49.66,5.46 | 43.78,13.76 R52.1 | R56.2 32.51,3.6 32.51,3.56
  Top 0.305: 43.78,13.76 46.77,13.76 v47.88,14.86
  Top 0.406: IC4.11 31.75,4.95 32.3,4.41 R56.2
  Bottom 0.254: v35.43,1.78 36.7,0.51 49.78,0.51 v50.67,1.4 | v49.66,5.46 49.66,14.61 49.4,14.86 v47.88,14.86
N$36
  Top 0.254: R48.2 23.88,1.82 23.88,1.02 27.69,1.02 27.69,1.65 26.92,2.41 26.92,5.08 27.18,5.33 27.18,6.99 27.43,7.24 30.23,7.24 30.48,6.99 IC4.10
  Top 0.406: IC4.10 30.48,5.08 31.24,4.32 31.24,2.96 R44.2
N$37
  Top 0.254: 34.29,7.37 35.05,8.13 41.78,8.13 42.67,7.24
  Top 0.406: 34.29,7.37 IC4.13 34.29,4.1 R56.1 34,3.17 R44.1 | 42.67,7.24 42.67,5.44 IC3.12
N$38  (via drill 0.3)
  Top 0.254: R36.2 49.06,14.14 v48.9,13.97 | v41.4,3.17 41.4,5.18 IC3.11
  Bottom 0.254: v48.9,13.97 48.9,8.38 45.09,4.57 41.4,4.57 v41.4,3.17
N$39
  Top 0.254: R32.1 48.26,17.31 48.26,17.14 47.5,16.38 47.5,16.3 R26.2 47.12,16.13 45.97,17.27 45.97,17.36 R27.2
N$40
  Top 0.254: 50.16,17.82 49.96,17.61 C10.2
  Top 0.61: R28.2 50.93,19.94 50.16,19.18 50.16,17.82
N$41  (via drill 0.3)
  Top 0.254: R50.1 16.26,14.1 17.53,14.1 18.29,14.86 22.35,14.86 22.61,15.11 27.05,15.11 v27.81,15.88 | R54.2 28.7,14.31 v28.7,14.86
  Top 0.406: R54.2 27.69,14.1 27.43,13.84 27.43,11.49 IC4.7
  Bottom 0.254: v28.7,14.86 27.81,15.75 v27.81,15.88
N$42
  Top 0.254: 28.96,11.24 28.96,9.53 27.43,9.53 27.18,9.78 27.18,10.79 26.92,11.05 26.92,11.56 25.4,11.56 24.38,12.57 22.99,12.57 22.61,12.19 22.61,9.24 23.67,8.18 R46.2
  Top 0.406: R42.2 28.49,12.66 28.96,12.19 28.96,11.24 IC4.6
N$43
  Top 0.254: IC4.1 35.56,13.72 34.29,14.99 30.48,14.99 30.23,14.73 30.23,14.14 R54.1
  Top 0.406: IC4.1 35.56,9.91 35.94,9.53 39.62,9.53 40.26,10.16 IC3.5 | R42.1 R54.1
N$44  (via drill 0.3)
  Top 0.254: v40.77,9.27 40.89,9.27 40.89,12.95 38.99,12.95 38.99,12.19 38.86,12.19 38.86,11.58 IC3.6 | R34.2 25.82,14.26 v26.04,14.48
  Bottom 0.254: v26.04,14.48 26.16,14.48 28.7,11.94 28.7,9.91 29.08,9.53 31.88,9.53 33.27,8.13 39.75,8.13 40.77,9.14 v40.77,9.27
N$45
  Top 0.254: 19.25,15.78 R20.2
  Top 0.305: R21.2 19.01,15.73 R30.1
  Top 0.406: 19.25,15.78 R30.1 19.01,15.85
N$46
  Top 0.61: R22.2 22.86,23.77 22.86,19.94 22.1,19.18 22.1,18.37 C8.2
N$47  (via drill 0.3)
  Top 0.254: IC4.9 29.21,1.27 29.84,0.64 44.83,0.64 47.5,3.3 47.5,6.6 v45.47,8.64 | v41.91,14.61 41.91,15.24 R51.1
  Top 0.406: R55.2 28.57,3.81 29.08,4.32 29.08,5.66 IC4.9
  Bottom 0.254: v45.47,8.64 45.47,11.05 v41.91,14.61
N$48
  Top 0.254: R47.2 23.8,5 23.11,4.32 23.11,0.89 23.5,0.51 27.94,0.51 28.57,1.14 28.57,2.29
  Top 0.406: IC4.8 27.94,5.08 27.43,4.57 27.43,2.79 27.56,2.67 28.49,2.67 R43.2 28.36,2.5 28.57,2.29
N$49
  Top 0.254: 35.56,6.99 35.94,7.37 38.61,7.37 38.99,6.99 IC3.9 | IC4.14 35.56,4.45 36.45,3.56 36.45,1.52 36.07,1.14 30.99,1.14 30.35,1.78 30.35,2.5
  Top 0.406: IC4.14 35.56,6.99 | R55.1 R43.1 30.35,2.5
N$50  (via drill 0.3)
  Top 0.254: v36.58,6.35 36.68,6.35 IC3.8 | R35.2 26.42,10.33 v26.42,9.91
  Bottom 0.254: v36.58,6.35 36.07,6.86 26.92,6.86 26.42,7.37 v26.42,9.91
N$51
  Top 0.254: R24.2 40.34,16.8 R23.2 38.95,16.71 R31.1
N$52
  Top 0.61: R25.2 35.81,20.03 C9.2
V_CAN
  Bottom 0.61: X6.2 56.01,7.62 56.64,8.26 56.64,12.95 SJ1.3
V_INPUT
  Top 1.27: X7.2 D6.A | D6.A D7.A | D6.A D5.A
V_LED
  Top 0.254: 10.39,33.15 10.39,34.51 17.27,34.51 X2.1 17.23,33.15 | 17.3,33.15 17.3,34.51 23.16,34.51 C2.1 24.56,32.18 D2.C 29.46,32.18 | IC1.8 18.04,22.73 | X3.1 39.12,34.54 45.34,34.54 | 45.34,34.54 X4.1 | 45.34,34.54 50.93,34.54 50.93,33.53 C4.1 53.47,33.53 D4.C
  Top 0.61: 17.23,33.15 17.23,32.85 15.49,31.11 15.49,25.78 16.38,24.89 16.38,24 C5.2 16.79,23.98 IC1.8 | 29.46,32.18 R58.2 | IC2.8 45.68,22.73 C6.2 43.69,24.73 43.69,31.88 44.96,33.15 X4.1
  Top 1.27: D1.C 4.35,32.77 4.35,33.59 C1.1 7.87,33.15 X1.1 10.39,33.15 | X2.1 17.3,33.15 | C14.+ 9.91,8.51 7.87,10.54 D7.C D6.C D5.C 2.41,10.93 2.41,12.06 1.52,12.95 1.52,31.11 3.17,32.77 4.09,32.77 4.22,32.89
  Top 1.676: 29.46,32.18 31.92,32.18 D3.C 32.77,32.26 34.16,33.66 C3.1 38.6,33.66 X3.1 | 4.22,32.89 4.35,32.77
  Bottom 0.406: SJ1.1 55.63,19.43 52.7,22.35 52.7,24.64 51.94,25.4 51.94,30.1 50.93,31.11 47.37,31.11 X4.1
  pour Bottom: 0.5,0.5 0.5,37.5 57.5,37.5 57.5,24 5,24 5,0.5
  pour Top: 0.5,0.5 0.5,37.5 57.5,37.5 57.5,24 5,24 5,0.5
VCC  (via drill 0.3)
  Top 0.203: IC3.10 40.26,6.22 40.89,6.86 41.78,6.86 42.16,6.48 42.16,4.06 42.42,3.81 43.56,3.81 44.2,4.45 43.94,5.18 | 43.43,10.29 43.43,12.83 45.21,12.83 45.34,12.7 IC3.1
  Top 0.254: 21.84,5.84 21.84,2.54 21.16,2.54 R48.1 | R45.1 20.95,12.33 | 12.19,14.35 12.19,15.07 R18.1 | IC3.13 43.94,5.18 | 40.39,13.72 R24.1 | 43.43,10.29 43.43,9.14 41.53,9.14 IC3.4 | 21.84,7.24 24.77,7.24 25.15,7.62 C12.2 25.15,8.13 25.53,8.51 31.75,8.51 33.02,9.78 IC4.3 | 21.84,7.24 21.84,9.03 R46.1 | R57.1 18.71,13.55 19.94,12.32 v20.45,12.32 | R27.1 45.72,14.61 43.05,14.61 42.8,14.35 42.8,13.08 43.05,12.83 43.43,12.83 | R47.1 21.03,5.84 21.84,5.84 | 21.84,7.24 21.84,5.84
  Top 0.406: C11.2 45.82,4.83 IC3.14 | IC3.14 IC3.13 | IC3.4 41.53,13.34 41.15,13.72 40.39,13.72 v36.45,13.72 | IC4.3 33.02,11.68 v33.53,11.68 | R18.1 12.32,15.07 12.32,14.22 13.34,13.21 v16.51,13.21 18.03,13.21 18.67,13.84 R57.1 | R21.1 17.4,15.57 v17.4,14.86 | R45.1 v20.45,12.32 | v20.7,9.65 21.02,9.33 R46.1 | IC3.1 45.21,11.33 45.21,10.29 44.7,9.78 44.7,7.49 45.34,6.86 IC3.14
  Bottom 0.254: 34.31,17.29 33.4,16.38 30.99,16.38 30.99,18.16 33.27,20.45 33.27,21.46 33.02,21.72 29.46,21.72
  Bottom 0.406: 34.42,12.95 35.69,12.95 v36.45,13.72 | v33.53,11.68 33.4,11.68 34.54,12.83 34.42,12.83 34.42,12.95 | 34.31,17.29 X5.5V 34.42,17.32 34.42,12.95 | 29.46,21.72 29.46,28.83 27.56,28.83 26.92,29.46 26.92,34.8 JP1.1 | v17.4,14.86 16.51,13.97 v16.51,13.21 | v20.45,12.32 20.7,12.06 v20.7,9.65

### Text on the board
Document: Creative Commons Attribution-Share Alike 3.0 Unported License | This work by http://projekt.auml.se is licensed under a | http://creativecommons.org/licenses/by-sa/3.0/